# Altium schematic sheet SCHMETIC ESP32 4LAYER.SchDoc
size A4; SheetNumber: 1; SheetTotal: 1
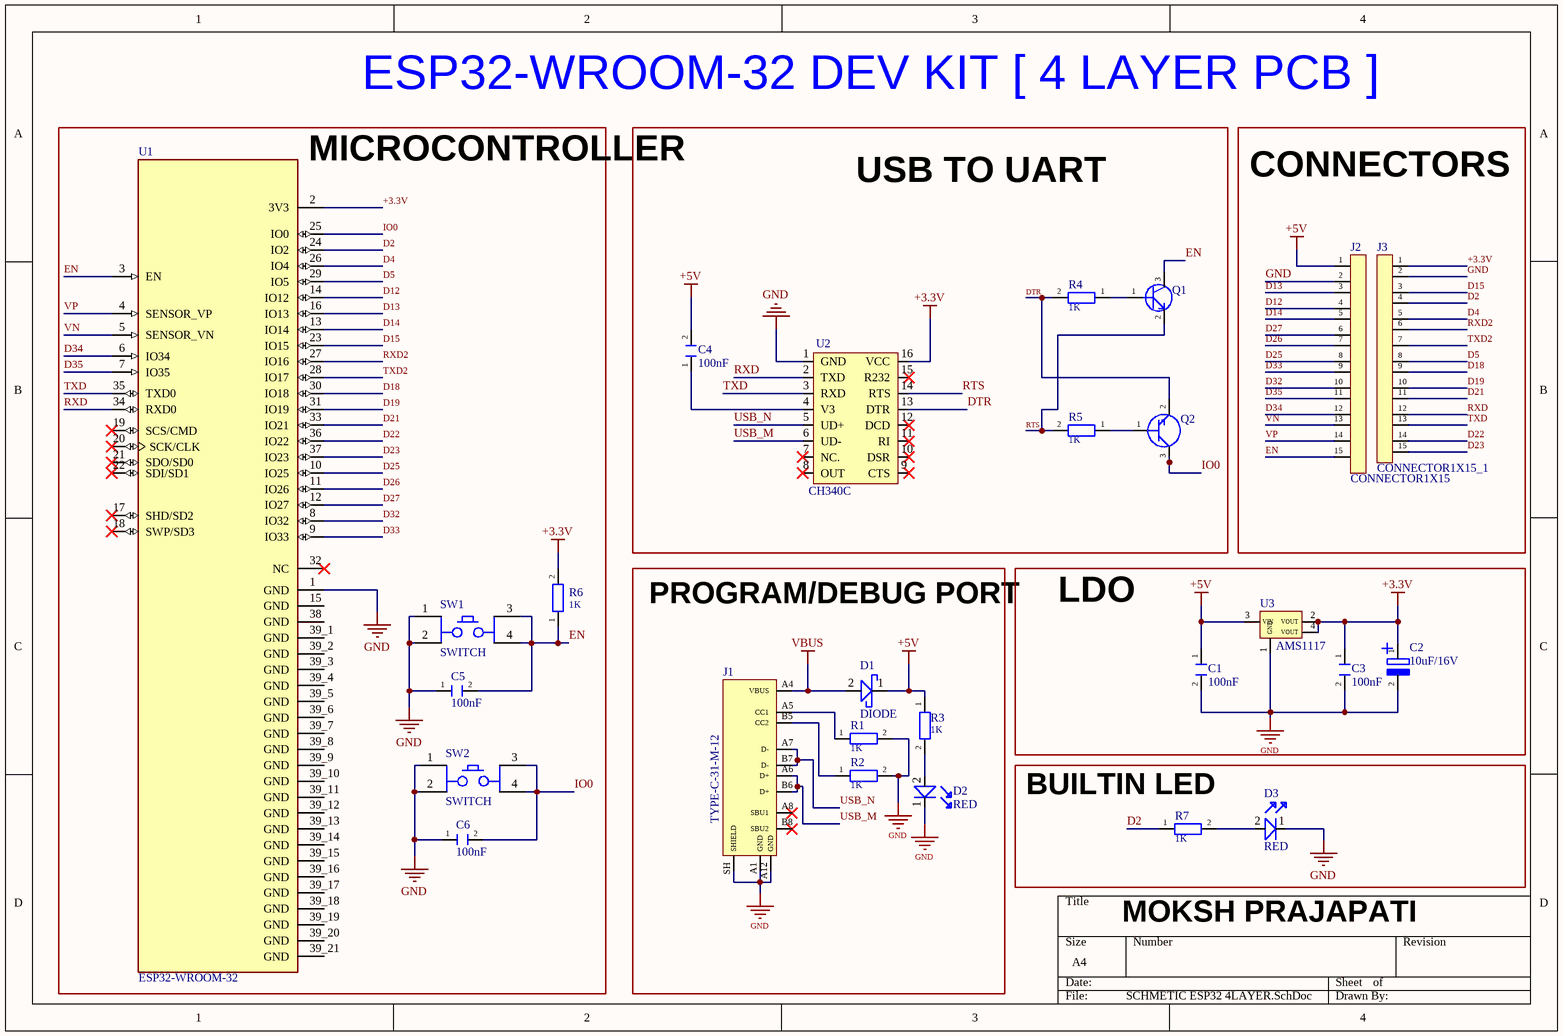
[diagram p0: SCHMETIC ESP32 4LAYER.SchDoc]

## Parts
C1  100nF  [CAPACITOR0603-100nF]
C2  10uF/16V  [CAPACITOR0805-10uF]
C3  100nF  [CAPACITOR0603-100nF]
C4  100nF  [CAPACITOR0603-100nF]
C5  100nF  [CAPACITOR0603-100nF]
C6  100nF  [CAPACITOR0603-100nF]
D1  DIODE  [Schottky diode]
D2  RED  [LED0603-RED]
D3  RED  [LED0603-RED]
J1  TYPE-C-31-M-12  [USB_TYPE_C]
J2  CONNECTOR1X15  [1X15 PIN HEADER]
J3  CONNECTOR1X15_1  [1X15 PIN HEADER]
Q1  MMBT3904LT1G  [NPN Transistor]  (value not drawn)
Q2  MMBT3904LT1G  [NPN Transistor]  (value not drawn)
R1  1K  [RESISTOR0603-1k]
R2  1K  [RESISTOR0603-1k]
R3  1K  [RESISTOR0603-1k]
R4  1K  [RESISTOR0603-1k]
R5  1K  [RESISTOR0603-1k]
R6  1K  [RESISTOR0603-1k]
R7  1K  [RESISTOR0603-1k]
SW1  SWITCH  [PUSHBUTTON]
SW2  SWITCH  [PUSHBUTTON]
U1  ESP32-WROOM-32  [MODULE_ESP32-WROOM-32]
U2  CH340C  [CH340C]
U3  AMS1117  [AMS1117-3.3]

## Blocks framed on the sheet
MICROCONTROLLER: C5 C6 R6 SW1 SW2 U1
USB TO UART: C4 Q1 Q2 R4 R5 U2
CONNECTORS: J2 J3
PROGRAM/DEBUG PORT: D1 D2 J1 R1-R3
LDO: C1-C3 U3
BUILTIN LED: D3 R7

## Nets
+3.3V: C2.1(+) C3.1 J3.1 R6.2 U1.2(3V3) U2.16(VCC) U3.2(VOUT) U3.4(VOUT)
+5V: C1.1 C4.2 D1.1(-) J2.1 R3.1 U3.3(VIN)
GND: C1.2 C2.2(-) C3.2 C5.1 C6.1 D2.1(-) D3.1(-) J1.A1(GND) J1.A12(GND) J1.SH(SHIELD) J2.2 J3.2 R1.2 R2.2 SW1.1 SW1.2 SW2.1 SW2.2 U1.1(GND) U2.1(GND) U3.1(GND)
VBUS: D1.2(+) J1.A4(VBUS)
D2: J3.4 R7.1 U1.24(IO2)
D4: J3.5 U1.26(IO4)
D5: J3.8 U1.29(IO5)
D12: J2.4 U1.14(IO12)
D13: J2.3 U1.16(IO13)
D14: J2.5 U1.13(IO14)
D15: J3.3 U1.23(IO15)
D18: J3.9 U1.30(IO18)
D19: J3.10 U1.31(IO19)
D21: J3.11 U1.33(IO21)
D22: J3.14 U1.36(IO22)
D23: J3.15 U1.37(IO23)
D25: J2.8 U1.10(IO25)
D26: J2.7 U1.11(IO26)
D27: J2.6 U1.12(IO27)
D32: J2.10 U1.8(IO32)
D33: J2.9 U1.9(IO33)
D34: J2.12 U1.6(IO34)
D35: J2.11 U1.7(IO35)
DTR: Q2.2(B) R4.2 U2.13(DTR)
EN: C5.2 J2.15 Q1.3(B) R6.1 SW1.3 SW1.4 U1.3(EN)
IO0: C6.2 Q2.3(B) SW2.3 SW2.4 U1.25(IO0)
RTS: Q1.2(B) R5.2 U2.14(RTS)
RXD: J3.12 U1.34(RXD0) U2.2(TXD)
RXD2: J3.6 U1.27(IO16)
TXD: J3.13 U1.35(TXD0) U2.3(RXD)
TXD2: J3.7 U1.28(IO17)
USB_M: J1.A6(D+) J1.B6(D+) U2.6(UD-)
USB_N: J1.A7(D-) J1.B7(D-) U2.5(UD+)
VN: J2.13 U1.5(SENSOR_VN)
VP: J2.14 U1.4(SENSOR_VP)
NetC4_1: C4.1 U2.4(V3)
NetD2_2: D2.2(+) R3.2
NetD3_2: D3.2(+) R7.2
NetJ1_A5: J1.A5(CC1) R1.1
NetJ1_B5: J1.B5(CC2) R2.1
NetQ1_1: Q1.1(B) R4.1
NetQ2_1: Q2.1(B) R5.1

Not connected (* = marked no-connect by the designer): J1 A8(SBU1)* B8(SBU2)*; U1 15(GND) 17(SHD/SD2)* 18(SWP/SD3)* 19(SCS/CMD)* 20(SCK/CLK)* 21(SDO/SD0)* 22(SDI/SD1)* 32(NC)* 38(GND) 39_1(GND) 39_2(GND) 39_3(GND) 39_4(GND) 39_5(GND) 39_6(GND) 39_7(GND) 39_8(GND) 39_9(GND) 39_10(GND) 39_11(GND) 39_12(GND) 39_13(GND) 39_14(GND) 39_15(GND) 39_16(GND) 39_17(GND) 39_18(GND) 39_19(GND) 39_20(GND) 39_21(GND); U2 7(NC.)* 8(OUT)* 9(CTS)* 10(DSR)* 11(RI)* 12(DCD)* 15(R232)*

## Notes on the sheet
- ESP32-WROOM-32 DEV KIT [ 4 LAYER PCB ]
- MOKSH PRAJAPATI

## Library data of the parts
C1 C3-C6 = CAPACITOR..: UNPOLERIZED
C2 = TANTALUM CAPACITOR
D2 D3 = LED
J1 = USB TYPE C
Q1 = NPN TRANSISTOR
Q2 = NPN TRANSISTOR_1
R1-R7 = RES0805
SW1 SW2 = SWITCH: SWITCH PUSH SPST-NO 0.1A 32V; Current Rating: 100mA; Electrical Life: 250000Cycles; Power Rating: 3W; Number of Terminals/Pins: 4; Actuator Length: 7mm; Actuator Type: Round, Button; Actuator Color: Grey; Operating Force: 1.3N; Row Spacing: 5mm; Throw Configuration: SPST; Switch Function: Off-Mom; Lead Free: Lead Free; Min Operating Temperature: -20°C; Series: D6; Voltage Rating (DC): 32V; Package Quantity: 2500; Max Operating Temperature: 85°C; Contact Plating: Silver; Packaging: Bulk; Color: Grey; RoHS Compliant: No; Max Voltage Rating (DC): 32V; Terminal Pitch: 5mm; Number of Pins: 4; Orientation: Straight; Mount: Through Hole; Termination: PC Pin; Diameter: 12mm; Max Current Rating: 100mA
U1 = ESP32-WROOM-32: Bluetooth, WiFi 802.11b/g/n, Bluetooth v4.2 +EDR, Class 1, 2 and 3 Transceiver Module 2.4GHz ~ 2.5GHz Antenna Not Included, U.FL Surface Mount; MF: Espressif Systems; Price: None; Availability: In Stock; MP: ESP32-WROOM-32; Package: Module Espressif Systems; SnapEDA_Link: https://www.snapeda.com/parts/ESP32-WROOM-32/Espressif+Systems/view-part/?ref=snap; Check_prices: https://www.snapeda.com/parts/ESP32-WROOM-32/Espressif+Systems/view-part/?ref=eda; Value: *; Purchase-URL: https://pricing.snapeda.com/search/part/ESP32-WROOM-32/?ref=eda